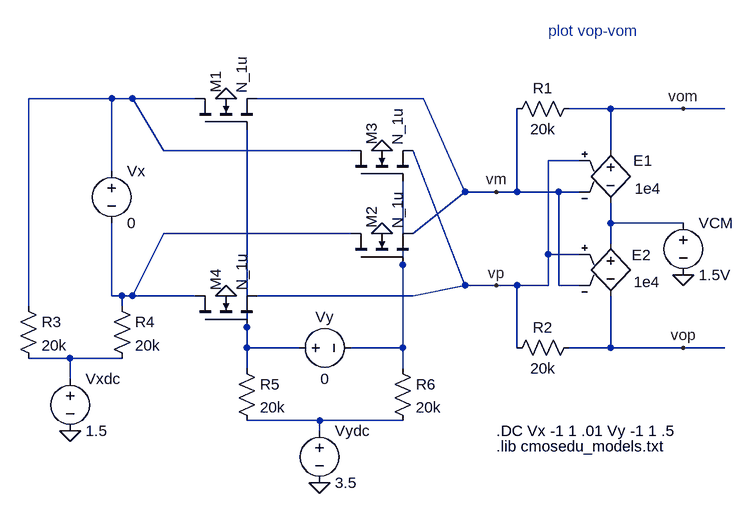
[diagram p0: schematic Fig27_27.asc]
Fig27_27.asc, the LTspice schematic file:
Version 4
SHEET 1 3580 680
WIRE 2448 -128 2448 -448
WIRE 2512 -48 2448 -48
WIRE 2512 -16 2512 -48
WIRE 2576 -448 2448 -448
WIRE 2576 -336 2576 -448
WIRE 2576 -144 2576 -256
WIRE 2592 -144 2576 -144
WIRE 2592 -128 2592 -144
WIRE 2592 -48 2512 -48
WIRE 2608 -448 2576 -448
WIRE 2608 -144 2592 -144
WIRE 2656 -368 2608 -448
WIRE 2656 -240 2608 -144
WIRE 2704 -448 2608 -448
WIRE 2704 -144 2608 -144
WIRE 2784 -96 2784 -400
WIRE 2784 -64 2784 -96
WIRE 2784 -32 2784 -64
WIRE 2864 -64 2784 -64
WIRE 2896 48 2784 48
WIRE 2896 64 2896 48
WIRE 2944 -368 2656 -368
WIRE 2944 -240 2656 -240
WIRE 3024 -192 3024 -320
WIRE 3024 -64 2944 -64
WIRE 3024 -64 3024 -192
WIRE 3024 -32 3024 -64
WIRE 3024 48 2896 48
WIRE 3040 -144 2800 -144
WIRE 3056 -448 2800 -448
WIRE 3120 -304 3040 -240
WIRE 3120 -304 3056 -448
WIRE 3120 -160 3040 -368
WIRE 3120 -160 3040 -144
WIRE 3168 -304 3120 -304
WIRE 3168 -160 3120 -160
WIRE 3200 -304 3168 -304
WIRE 3200 -304 3200 -432
WIRE 3200 -160 3168 -160
WIRE 3200 -64 3200 -160
WIRE 3248 -208 3248 -352
WIRE 3248 -160 3200 -160
WIRE 3248 -160 3248 -208
WIRE 3264 -304 3200 -304
WIRE 3264 -160 3264 -304
WIRE 3296 -352 3248 -352
WIRE 3296 -304 3264 -304
WIRE 3296 -208 3248 -208
WIRE 3296 -160 3264 -160
WIRE 3344 -432 3280 -432
WIRE 3344 -368 3344 -432
WIRE 3344 -256 3344 -288
WIRE 3344 -224 3344 -256
WIRE 3344 -64 3280 -64
WIRE 3344 -64 3344 -144
WIRE 3456 -432 3344 -432
WIRE 3456 -256 3344 -256
WIRE 3456 -64 3344 -64
WIRE 3520 -432 3456 -432
WIRE 3520 -64 3456 -64
FLAG 3456 -176 0
FLAG 3168 -304 vm
FLAG 3168 -160 vp
FLAG 3456 -432 vom
FLAG 3456 -64 vop
FLAG 2752 -448 0
FLAG 2992 -240 0
FLAG 2992 -368 0
FLAG 2752 -144 0
FLAG 2512 64 0
FLAG 2896 144 0
SYMBOL e 3344 -384 R0
WINDOW 0 35 32 Left 0
WINDOW 3 37 75 Left 0
SYMATTR InstName E1
SYMATTR Value 1e4
SYMBOL e 3344 -240 R0
WINDOW 0 33 33 Left 0
WINDOW 3 36 75 Left 0
SYMATTR InstName E2
SYMATTR Value 1e4
SYMBOL voltage 3456 -272 R0
SYMATTR InstName VCM
SYMATTR Value 1.5V
SYMBOL res 3184 -416 R270
WINDOW 0 32 56 VTop 0
WINDOW 3 0 56 VBottom 0
SYMATTR InstName R1
SYMATTR Value 20k
SYMBOL res 3296 -80 R90
WINDOW 0 0 56 VBottom 0
WINDOW 3 32 56 VTop 0
SYMATTR InstName R2
SYMATTR Value 20k
SYMBOL nmos4 2704 -400 R270
SYMATTR InstName M1
SYMATTR Value N_1u
SYMATTR Value2 l=2u w=10u
SYMBOL nmos4 2944 -192 R270
SYMATTR InstName M2
SYMATTR Value N_1u
SYMATTR Value2 l=2u w=10u
SYMBOL nmos4 2944 -320 R270
SYMATTR InstName M3
SYMATTR Value N_1u
SYMATTR Value2 l=2u w=10u
SYMBOL nmos4 2704 -96 R270
SYMATTR InstName M4
SYMATTR Value N_1u
SYMATTR Value2 l=2u w=10u
SYMBOL voltage 2576 -352 R0
SYMATTR InstName Vx
SYMATTR Value 0
SYMBOL voltage 2512 -32 R0
SYMATTR InstName Vxdc
SYMATTR Value 1.5
SYMBOL voltage 2896 48 R0
SYMATTR InstName Vydc
SYMATTR Value 3.5
SYMBOL voltage 2848 -64 R270
WINDOW 0 32 56 VTop 0
WINDOW 3 -32 56 VBottom 0
SYMATTR InstName Vy
SYMATTR Value 0
SYMBOL res 2432 -144 R0
SYMATTR InstName R3
SYMATTR Value 20k
SYMBOL res 2576 -144 R0
SYMATTR InstName R4
SYMATTR Value 20k
SYMBOL res 2768 -48 R0
SYMATTR InstName R5
SYMATTR Value 20k
SYMBOL res 3008 -48 R0
SYMATTR InstName R6
SYMATTR Value 20k
TEXT 3168 88 Left 0 !.lib cmosedu_models.txt
TEXT 3248 -552 Left 0 ;plot vop-vom
TEXT 3168 64 Left 0 !.DC Vx -1 1 .01 Vy -1 1 .5

The netlist it stands for:
* Fig27_27.asc
E1 vom N007 vp vm 1e4
E2 N007 vop vp vm 1e4
VCM N007 0 1.5V
R1 vm vom 20k
R2 vop vp 20k
M1 N001 N004 vm 0 N_1u l=2u w=10u
M2 N003 N006 vm 0 N_1u l=2u w=10u
M3 N001 N006 vp 0 N_1u l=2u w=10u
M4 N003 N004 vp 0 N_1u l=2u w=10u
Vx N001 N003 0
Vxdc N002 0 1.5
Vydc N005 0 3.5
Vy N004 N006 0
R3 N001 N002 20k
R4 N003 N002 20k
R5 N004 N005 20k
R6 N006 N005 20k
.model NMOS NMOS
.model PMOS PMOS
.lib standard.mos
.lib cmosedu_models.txt
* plot vop-vom
.DC Vx -1 1 .01 Vy -1 1 .5
.backanno
.end